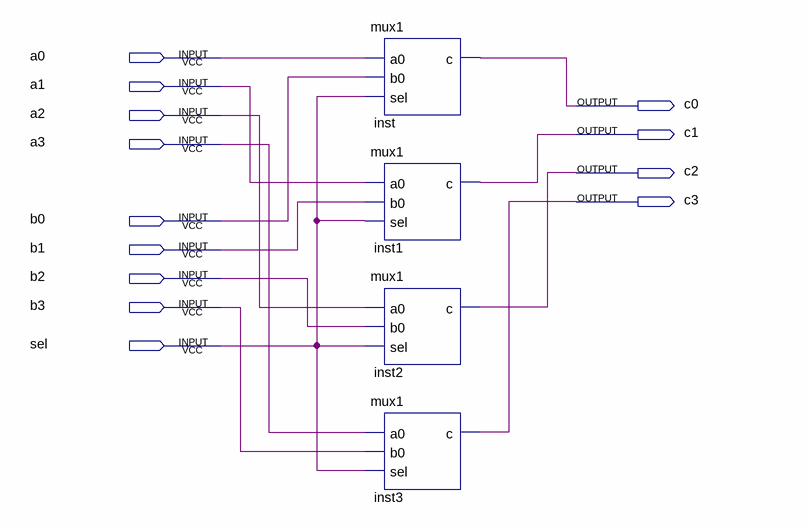
[diagram p0: schematic sheet]
// Quartus schematic mux4.bdf as structural Verilog: 4 symbols, 13 pins
module mux4 (
  input  a0,
  input  a1,
  input  a2,
  input  a3,
  input  b0,
  input  b1,
  input  b2,
  input  b3,
  input  sel,
  output c0,
  output c1,
  output c2,
  output c3
);

  mux1 inst (.a0(a0), .b0(b0), .sel(sel), .c(c0));
  mux1 inst1 (.a0(a1), .b0(b1), .sel(sel), .c(c1));
  mux1 inst2 (.a0(a2), .b0(b2), .sel(sel), .c(c2));
  mux1 inst3 (.a0(a3), .b0(b3), .sel(sel), .c(c3));
endmodule
